# EAGLE design working (EAGLE 6.4)
COMPANY: ADAFRUIT INDUSTRIES; DRAWN: KTOWN; REV: B
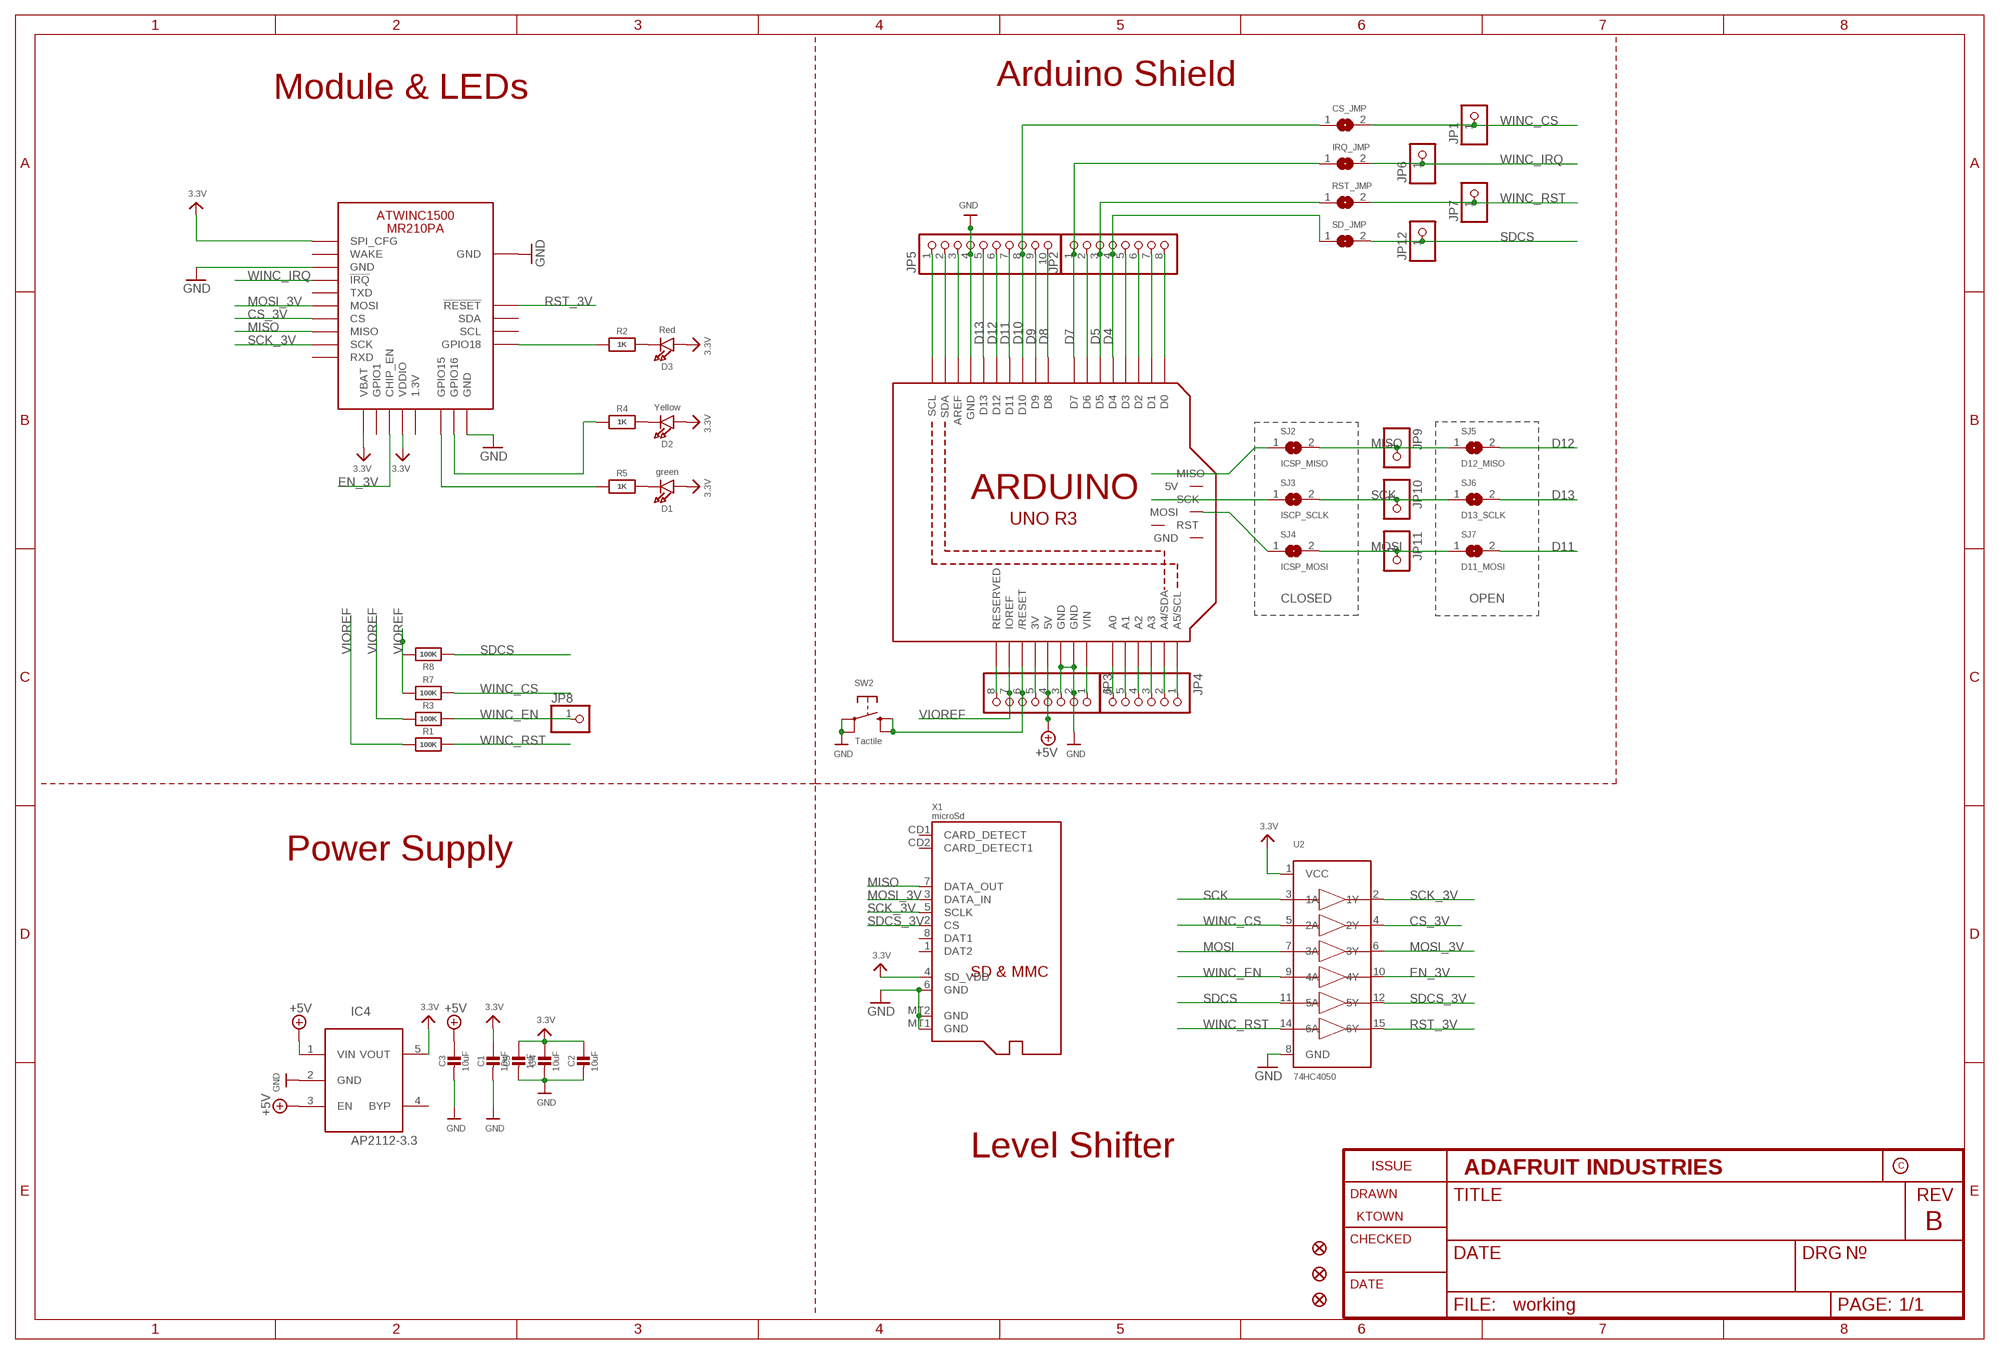
[diagram p0: schematic, sheet 1]

## Parts
C1  10uF  CAP_CERAMIC0805-NOOUTLINE  [0805-NO]
C2  10uF  CAP_CERAMIC0805-NOOUTLINE  [0805-NO]
C3  10uF  CAP_CERAMIC0805-NOOUTLINE  [0805-NO]
C4  10uF  CAP_CERAMIC0805-NOOUTLINE  [0805-NO]
C5  1uF  CAP_CERAMIC0805-NOOUTLINE  [0805-NO]
CS_JMP  SOLDERJUMPERCLOSED  [SOLDERJUMPER_CLOSEDWIRE]
D1  green  LED0805_NOOUTLINE  [CHIPLED_0805_NOOUTLINE]
D2  Yellow  LED0805_NOOUTLINE  [CHIPLED_0805_NOOUTLINE]
D3  Red  LED0805_NOOUTLINE  [CHIPLED_0805_NOOUTLINE]
FID1  FIDUCIAL_1MM  [FIDUCIAL_1MM]
FID2  FIDUCIAL_1MM  [FIDUCIAL_1MM]
FID3  FIDUCIAL_1MM  [FIDUCIAL_1MM]
IC4  AP2112-3.3  LP298XS  [SOT23-5L]
IRQ_JMP  SOLDERJUMPERCLOSED  [SOLDERJUMPER_CLOSEDWIRE]
JP1  HEADER-1X1ROUND  [1X01_ROUND]
JP2  HEADER-1X870MIL  [1X08_ROUND_70]
JP3  HEADER-1X870MIL  [1X08_ROUND_70]
JP4  HEADER-1X670MIL  [1X06_ROUND_70]
JP5  HEADER-1X1070MIL  [1X10_ROUND70]
JP6  HEADER-1X1ROUND  [1X01_ROUND]
JP7  HEADER-1X1ROUND  [1X01_ROUND]
JP8  HEADER-1X1ROUND  [1X01_ROUND]
JP9  HEADER-1X1ROUND  [1X01_ROUND]
JP10  HEADER-1X1ROUND  [1X01_ROUND]
JP11  HEADER-1X1ROUND  [1X01_ROUND]
JP12  HEADER-1X1ROUND  [1X01_ROUND]
M1  ARDUINO_R3_ICSP_NODIM  [ARDUINOR3_ICSP_NODIM]
R1  100K  RESISTOR0805_NOOUTLINE  [0805-NO]
R2  1K  RESISTOR0805_NOOUTLINE  [0805-NO]
R3  100K  RESISTOR0805_NOOUTLINE  [0805-NO]
R4  1K  RESISTOR0805_NOOUTLINE  [0805-NO]
R5  1K  RESISTOR0805_NOOUTLINE  [0805-NO]
R7  100K  RESISTOR0805_NOOUTLINE  [0805-NO]
R8  100K  RESISTOR0805_NOOUTLINE  [0805-NO]
RST_JMP  SOLDERJUMPERCLOSED  [SOLDERJUMPER_CLOSEDWIRE]
SD_JMP  SOLDERJUMPERCLOSED  [SOLDERJUMPER_CLOSEDWIRE]
SJ2  ICSP_MISO  SOLDERJUMPERCLOSED  [SOLDERJUMPER_CLOSEDWIRE]
SJ3  ISCP_SCLK  SOLDERJUMPERCLOSED  [SOLDERJUMPER_CLOSEDWIRE]
SJ4  ICSP_MOSI  SOLDERJUMPERCLOSED  [SOLDERJUMPER_CLOSEDWIRE]
SJ5  D12_MISO  SOLDERJUMPERREFLOW_NOPASTE  [SOLDERJUMPER_REFLOW_NOPASTE]
SJ6  D13_SCLK  SOLDERJUMPERREFLOW_NOPASTE  [SOLDERJUMPER_REFLOW_NOPASTE]
SJ7  D11_MOSI  SOLDERJUMPERREFLOW_NOPASTE  [SOLDERJUMPER_REFLOW_NOPASTE]
SW2  Tactile  SWITCH_TACT_SMT_EVQQ2_SMALL  [EVQ-Q2_SMALLER]
U2  74HC4050  74HC4050D  [SOIC16]
U$1  ATWINC1500_MR210PB  ATWINC1500_MR210PA  [ATWINC1500_MR210PA]
X1  microSd  MICROSD  [MICROSD]

## Nets
3.3V: C1.1 C2.1 C4.1 C5.1 D1.A D2.A D3.A IC4.5(VOUT) U2.1(VCC) U$1.J10(SPI_CFG) U$1.J20(VBAT) U$1.J23(VDDIO) X1.4(SD_VDD)
+3V: JP3.5 M1.3V
+5V: C3.1 IC4.1(VIN) IC4.3(EN) JP3.4 M1.5V
A0: JP4.6 M1.A0
A1: JP4.5 M1.A1
A2: JP4.4 M1.A2
A3: JP4.3 M1.A3
A4: JP4.2 M1.A4(A4/SDA)
A5: JP4.1 M1.A5(A5/SCL)
AREF: JP5.3 M1.AREF
CS_3V: U2.4(2Y) U$1.J16(CS)
D0: JP2.8 M1.D0
D1: JP2.7 M1.D1
D2: JP2.6 M1.D2
D3: JP2.5 M1.D3
D4: JP2.4 M1.D4 SD_JMP.1
D5: JP2.3 M1.D5 RST_JMP.1
D6: JP2.2 M1.D6
D7: IRQ_JMP.1 JP2.1 M1.D7
D8: JP5.10 M1.D8
D9: JP5.9 M1.D9
D10: CS_JMP.1 JP5.8 M1.D10
D11: JP5.7 M1.D11 SJ7.2
D12: JP5.6 M1.D12 SJ5.2
D13: JP5.5 M1.D13 SJ6.2
EN_3V: U2.10(4Y) U$1.J22(CHIP_EN)
GND: C1.2 C2.2 C3.2 C4.2 C5.2 IC4.2(GND) JP3.2 JP3.3 JP5.4 M1.GND M1.GND@1(GND) M1.GND@3(GND) SW2.A'(P1) SW2.A(P) U2.8(GND) U$1.J9(GND) U$1.J12(GND) U$1.J28(GND) U$1.MTGND(GND) X1.6(GND) X1.MT1(GND) X1.MT2(GND)
GPIO15: R5.1 U$1.J26(GPIO15)
GPIO16: R4.1 U$1.J27(GPIO16)
MISO: JP9.1 SJ2.2 SJ5.1 U$1.J17(MISO) X1.7(DATA_OUT)
MISO_ICSP: M1.MISO SJ2.1
MOSI: JP11.1 SJ4.2 SJ7.1 U2.7(3A)
MOSI_3V: U2.6(3Y) U$1.J15(MOSI) X1.3(DATA_IN)
MOSI_ICSP: M1.MOSI SJ4.1
N$1: D3.C R2.2
N$5: D2.C R4.2
N$6: D1.C R5.2
N$8: R2.1 U$1.J1(GPIO18)
NC: JP3.8 M1.RESERVED
RESET: JP3.6 M1.RESET(/RESET) SW2.B'(S1) SW2.B(S)
RST_3V: U2.15(6Y) U$1.J4(!RESET)
SCK: JP10.1 SJ3.2 SJ6.1 U2.3(1A)
SCK_3V: U2.2(1Y) U$1.J18(SCK) X1.5(SCLK)
SCK_ICSP: M1.SCK SJ3.1
SCL: JP5.1 M1.SCL
SDA: JP5.2 M1.SDA
SDCS: JP12.1 R8.1 SD_JMP.2 U2.11(5A)
SDCS_3V: U2.12(5Y) X1.2(CS)
VIN: JP3.1 M1.VIN
VIOREF: JP3.7 M1.IOREF R1.1 R3.1 R7.1 R8.2
WINC_CS: CS_JMP.2 JP1.1 R7.2 U2.5(2A)
WINC_EN: JP8.1 R3.2 U2.9(4A)
WINC_IRQ: IRQ_JMP.2 JP6.1 U$1.J13(!IRQ)
WINC_RST: JP7.1 R1.2 RST_JMP.2 U2.14(6A)
Unconnected: IC4.4(BYP) M1.5V_ICSP(5V) M1.GND@2(GND) M1.RESET_ICSP(RST) U$1.J2(SCL) U$1.J3(SDA) U$1.J11(WAKE) U$1.J14(TXD) U$1.J19(RXD) U$1.J21(GPIO1) U$1.J24(1.3V) X1.1(DAT2) X1.8(DAT1) X1.CD1(CARD_DETECT) X1.CD2(CARD_DETECT1)

## Notes on the sheet
- Arduino Shield
- Module & LEDs
- CLOSED | OPEN
- Power Supply
- Level Shifter

## Library data of the parts
C1-C5 = microbuilder:CAP_CERAMIC: Ceramic Capacitors For new designs, use the packages preceded by an '_' character since they are more reliable: The following footprints should be used on most boards: _0402 - Standard footprint for regular board layouts _0603 - Standard footprint for regular board layouts _0805 - Standard footprint for regular board layouts _1206 - Standard footprint for regular board layouts For extremely tight-pitch boards where space is at a premium, the following 'micro-pitch' footprints can be used (smaller pads, no silkscreen outline, etc.): _0402MP - Micro-pitch footprint for very dense/compact boards _0603MP - Micro-pitch footprint for very dense/compact boards _0805MP - Micro-pitch footprint for very dense/compact boards _1206MP - Micro-pitch footprint for very dense/compact boards
CS_JMP IRQ_JMP RST_JMP SD_JMP SJ2-SJ7 = microbuilder:SOLDERJUMPER: SMD Solder JUMPER Solder the two pads together to create a connection, or remove the solder to break it. REFLOW - Use this footprint for solder paste and reflow ovens. WAVE - Use this footprint for hand-soldering (larger pads). CLOSED - Has a trace between the two pads to ensure it is closed by default. The trace needs to be cut to disable the jumper, and can be closed again by creating a solder bridge between the two pads.
D1-D3 = microbuilder:LED: LED 0603 - 0603 Surface Mount Package 2mA: Green LED - Low Power (3.9mcd, 2ma, 1.7Vf) - Digikey: 475-2709-2-ND Orange LED - Low Power (9.8mcd, 2ma, 1.8Vf) - Digikey: 475-1194-2-ND Red LED - Low Power (5mcd, 2ma, 1.8Vf) - Digikey: 475-1195-2-ND Yellow LED - Low Power (7mcd, 2ma, 1.8Vf) - Digikey: 475-1196-2-ND 5mA: Blue LED - Low Power (17mcd, 5ma, 2.9Vf) - Digikey: LNJ937W8CRACT-ND 0805 - 0805 Surface Mount Package 2mA: Red LED (8.8mcd, 2mA, 1.8Vf, Clear) - Low Power [Digikey: 475-2510-1-ND] Green LED (5mcd, 2mA, 1.8Vf, Clear) - Low Power [Digikey: 475-2730-1-ND] Yellow LED (11.3mcd, 2mA, 1.8Vf, Clear) - Low Power [Digikey: 475-2555-1-ND] 20mA: Red LED (104mcd, 20mA, Diffused) - LS R976 [Digikey: 475-1278-6-ND] Red LED (12mcd, 20mA, 2.0Vf, Clear) - APT2012EC [Digikey: 754-1128-1-ND] Green LED (15mcd, 20mA, 2.2Vf, Clear) - APT2012GC [Digikey: 754-1131-1-ND] Orange LED (160mcd, 20mA, 2.1Vf, Clear) - APT2012SECK [Digikey: 754-1130-1-ND] 1206 - 1206 Surface Mount Package Green LED (26mcd, 20mA, Diffused) - LG N971 [Digikey: 475-1407-6-ND] Red LED (15mcd, 20mA, Diffused) - LH N974 [Digikey: 475-1416-6-ND] Cree - Cree High-Power Surface Mount LEDs XPEBWT-L1-0000-00D50 - White 111lm 350mA 2.9Vf 6200K 110° XTEAWT-00-0000-00000LEE3 - White 114lm 350mA 2.85Vf 5000K 115° Everlight - Everlight 45-21 Series Surface Mount LEDs 45-21/QK2C-B2832AC2CB2/2T - Warm White 2000mcd 20mA 3.25Vf 3050K 120° 45-21/LK2C-B38452C4CB2/2T - Nuetral White 2000mcd 20mA 3.25Vf 4150K 120° 45-21/LK2C-B50634C6CB2/2T - Cold White 2200mcd 20mA 3.25Vf 5650K 120° PLCC2 Reverse Mount LS T77K-J1L2-1-0-2-R18-Z - Red 11.25mcd 2mA 1.8Vf 630nm 120° LO T77K-L1M2-24-Z - Orange 19.6mcd 2mA 1.8Vf 606nm 120° LY T77K-K2M1-26-Z - Yellow 15.7mcd 2mA 1.8Vf 587nm 120°
FID1-FID3 = microbuilder:FIDUCIAL: Fiducial Alignment Points Various fiducial points for machine vision alignment.; BOM: EXCLUDE
IC4 = adafruit:LP298X
JP1 JP6-JP12 = microbuilder:HEADER-1X1: PIN HEADER
JP2 JP3 = microbuilder:HEADER-1X8: PIN HEADER
JP4 = microbuilder:HEADER-1X6: PIN HEADER
JP5 = microbuilder:HEADER-1X10: PIN HEADER
M1 = adafruit:ARDUINO_R3_ICSP
R1-R5 R7 R8 = microbuilder:RESISTOR: Resistors For new designs, use the packages preceded by an '_' character since they are more reliable: The following footprints should be used on most boards: _0402 - Standard footprint for regular board layouts _0603 - Standard footprint for regular board layouts _0805 - Standard footprint for regular board layouts _1206 - Standard footprint for regular board layouts For extremely tight-pitch boards where space is at a premium, the following 'micro-pitch' footprints can be used (smaller pads, no silkscreen outline, etc.): _0402MP - Micro-pitch footprint for very dense/compact boards _0603MP - Micro-pitch footprint for very dense/compact boards _0805MP - Micro-pitch footprint for very dense/compact boards _1206MP - Micro-pitch footprint for very dense/compact boards
SW2 = microbuilder:SWITCH_TACT_SMT: SMT Tact Switches 6x6mm - Digikey: P12940SCT-ND KMR2 (4.6x2.8mm) - Digikey: 401-1426-1-ND EVQ-PQHB55 - Light Touch, 160GF (4.5x4.5mm) - Digikey: P8090SCT-ND KMT0 - KMT021 NGJ LHS (etc.) IP68/Waterproof - Digikey: CKN10289CT-ND
U2 = microbuilder:74HC4050D: 6-channel level shifter 74HC4050D - 2V-6V Supply SOIC16 Digikey: 74HC4050D,653-ND Mouser: 771-74HC4050D-T TSSOP16 Digikey: 296-9215-1-ND Mouser:
U$1 = microbuilder:ATWINC1500_MR210PA: ATWINC1500_MR210PA wifi module
X1 = microbuilder:MICROSD: MicroSD/Transflash Card Holder with SPI pinout 3M: 2908-05WB-MG 4UConnector: 19656 Footprint courtesy: Adafruit Industries

## Board
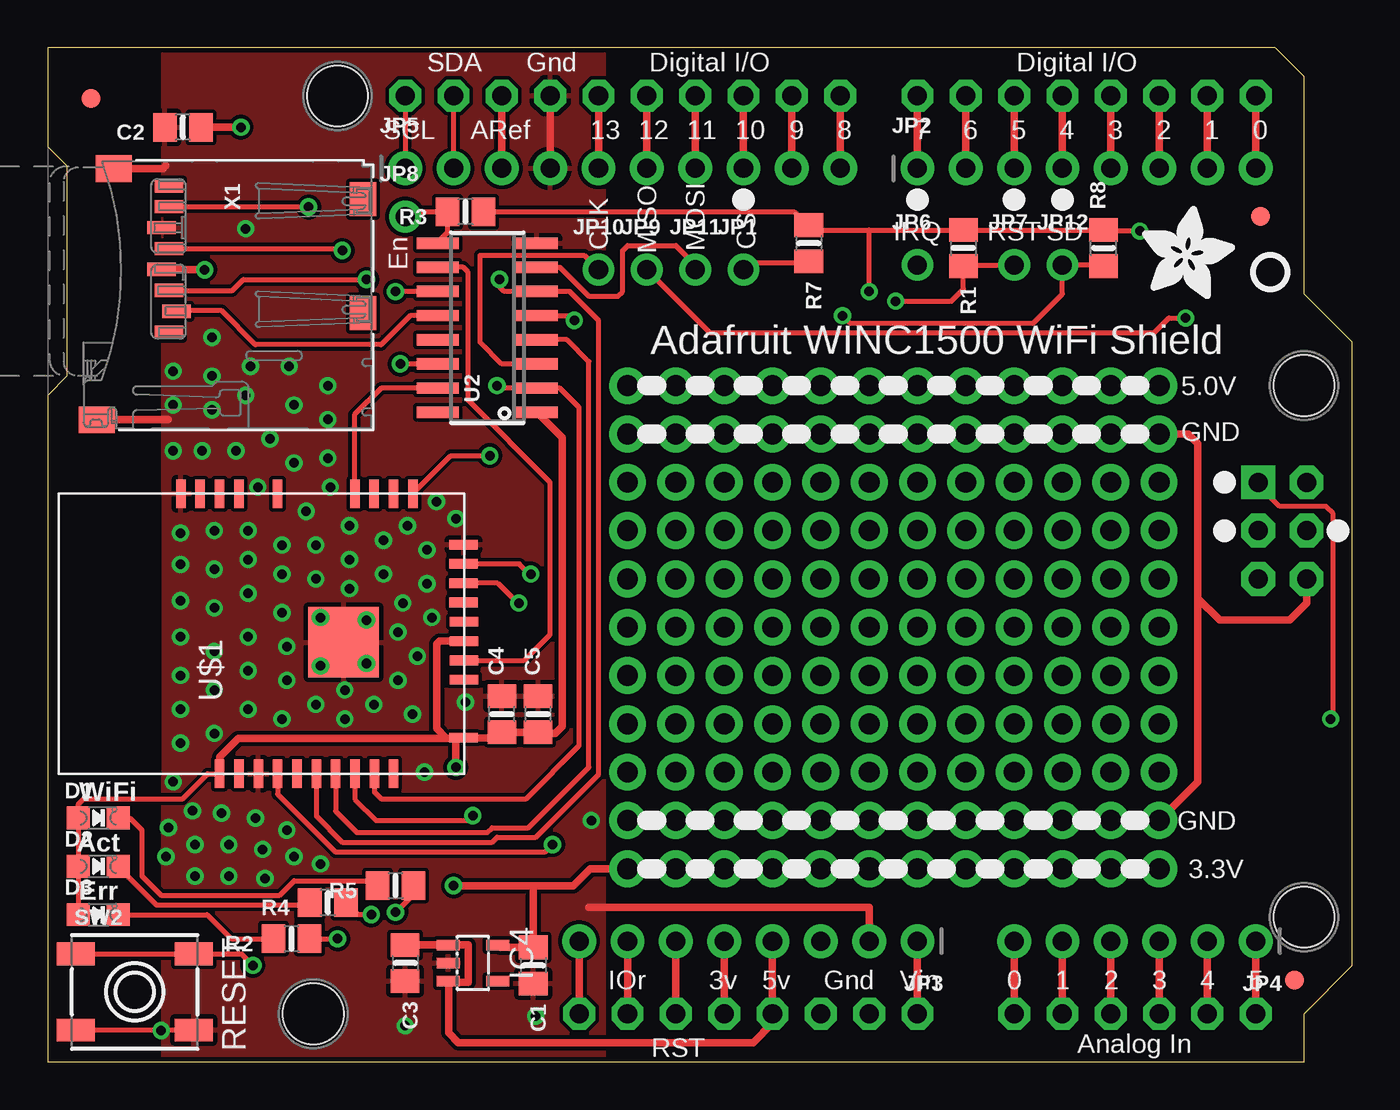
[diagram p1: board, top side]
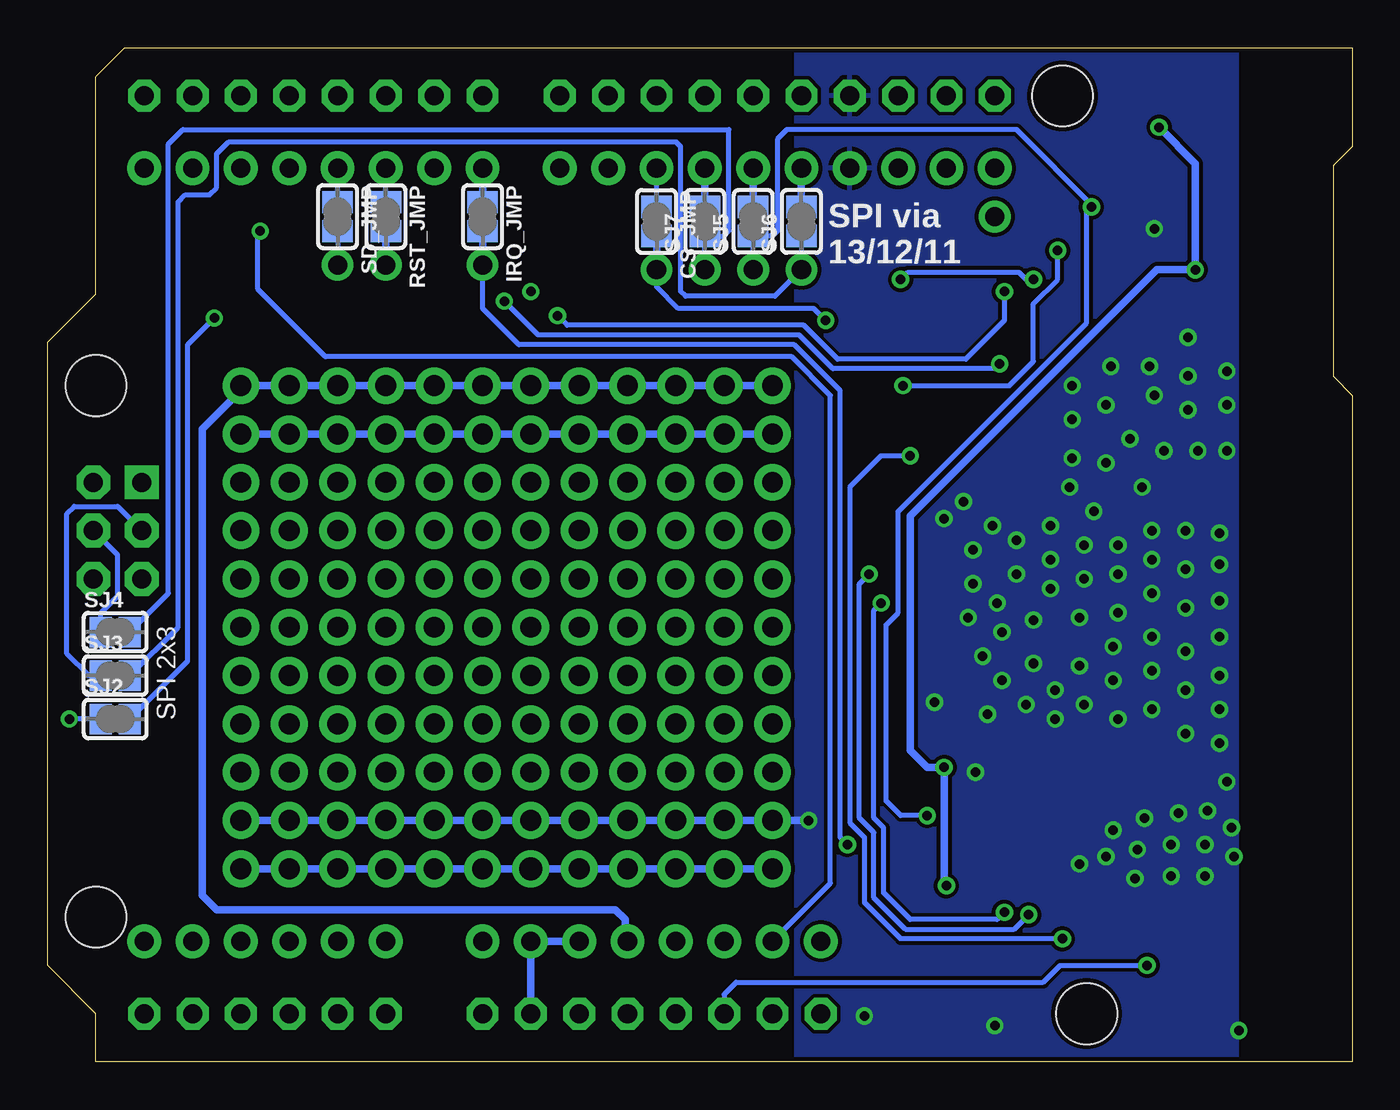
[diagram p2: board, bottom side, seen from below]

Size 68.58 x 53.34 mm. Coordinates in mm from the lower left corner, seen from the top.
Outline: 0,0 66.04,0 66.04,2.54 68.58,5.08 68.58,37.85 66.04,40.39 66.04,51.82 64.52,53.34 0,53.34 0,48.13 1.02,47.12 1.02,36.07 0,35.05 0,0
Copper layers (1*16): Top 0.035mm / dielectric 1.5mm / Bottom 0.035mm
Design rules "adafruit *": minimum track width 8mil, minimum drill 15.5mil, track to track 8mil, track to pad 8mil, pad to pad 8mil, via to via 8mil, smd to smd 8mil, copper to edge 10mil, drill to drill 8mil, minimum pad ring 10mil, minimum via ring 8mil, stop-mask expansion 2mil, vias tented up to drill 20mil, thermal gap 10mil
Holes 3.2 mm at 13.97,2.54 66.04,35.56 66.04,7.62 15.24,50.8

### Footprints (pad centres in the part's own frame; a part is rotated, then mirrored left to right if it is on the bottom)
0805-NO = smd 1.24 x 1.5: 1 -0.95,0; 2 0.95,0
SOLDERJUMPER_CLOSEDWIRE = smd 1.168 x 1.6: 1 -0.762,0; 2 0.762,0 | smd 0.635 x 0.203: WIRE 0,0
CHIPLED_0805_NOOUTLINE = smd 1.2 x 1.2: A 0,-1.05; C 0,1.05
FIDUCIAL_1MM = smd 1 x 1: 1 0,0
SOT23-5L = smd 0.55 x 1.2: 1 -0.95,-1.3; 2 0,-1.3; 3 0.95,-1.3; 4 0.95,1.3; 5 -0.95,1.3
1X01_ROUND = drill 1 pad 1.676: 1 0,0
1X08_ROUND_70 = drill 1 pad 1.778: 1 -8.89,0; 2 -6.35,0; 3 -3.81,0; 4 -1.27,0; 5 1.27,0; 6 3.81,0; 7 6.35,0; 8 8.89,0
1X06_ROUND_70 = drill 1 pad 1.778: 1 -6.35,0; 2 -3.81,0; 3 -1.27,0; 4 1.27,0; 5 3.81,0; 6 6.35,0
1X10_ROUND70 = drill 1 pad 1.778: 1 -11.43,0; 2 -8.89,0; 3 -6.35,0; 4 -3.81,0; 5 -1.27,0; 6 1.27,0; 7 3.81,0; 8 6.35,0; 9 8.89,0; 10 11.43,0
ARDUINOR3_ICSP_NODIM = drill 1 pad 1.676 octagon: 3V 35.56,2.54; 5V 38.1,2.54; A0 50.8,2.54; A1 53.34,2.54; A2 55.88,2.54; A3 58.42,2.54; A4 60.96,2.54; A5 63.5,2.54; AREF 23.876,50.8; D0 63.5,50.8; D1 60.96,50.8; D2 58.42,50.8; D3 55.88,50.8; D4 53.34,50.8; D5 50.8,50.8; D6 48.26,50.8; D7 45.72,50.8; D8 41.656,50.8; D9 39.116,50.8; D10 36.576,50.8; D11 34.036,50.8; D12 31.496,50.8; D13 28.956,50.8; GND 26.416,50.8; GND@1 43.18,2.54; GND@2 40.64,2.54; IOREF 30.48,2.54; RESERVED 27.94,2.54; RESET 33.02,2.54; SCL 18.796,50.8; SDA 21.336,50.8; VIN 45.72,2.54 | drill 1 pad 1.778 octagon: 5V_ICSP 66.167,30.48; GND@3 66.167,25.4; MOSI 66.167,27.94; RESET_ICSP 63.627,25.4; SCK 63.627,27.94 | drill 1 pad 1.778 square: MISO 63.627,30.48
SOLDERJUMPER_REFLOW_NOPASTE = smd 1.168 x 1.6: 1 -0.762,0; 2 0.762,0
EVQ-Q2_SMALLER = smd 2 x 1.2: A -3.1,-2; A' 3.1,-2; B -3.1,2; B' 3.1,2
SOIC16 = smd 0.6 x 2.2: 1 -4.445,-2.6; 2 -3.175,-2.6; 3 -1.905,-2.6; 4 -0.635,-2.6; 5 0.635,-2.6; 6 1.905,-2.6; 7 3.175,-2.6; 8 4.445,-2.6; 9 4.445,2.6; 10 3.175,2.6; 11 1.905,2.6; 12 0.635,2.6; 13 -0.635,2.6; 14 -1.905,2.6; 15 -3.175,2.6; 16 -4.445,2.6
ATWINC1500_MR210PA = smd 1.5 x 0.5: J1 7.146,-4.973; J2 7.146,-3.957; J3 7.146,-2.941; J4 7.146,-1.925; J5 7.146,2.139; J6 7.146,4.171; J7 7.146,5.187; J8 7.146,6.203; J9 7.146,7.219; J10 -7.584,5.181; J11 -7.584,4.165; J12 -7.584,3.149; J13 -7.584,2.133; J14 -7.584,1.117; J15 -7.584,0.101; J16 -7.584,-0.915; J17 -7.584,-1.931; J18 -7.584,-2.947; J19 -7.584,-3.963 | smd 0.5 x 1.5: J20 -5.684,-7.643; J21 -2.636,-7.663; J22 -1.62,-7.663; J23 -0.604,-7.663; J24 0.412,-7.663; J25 1.428,-7.643; J26 2.444,-7.643; J27 3.46,-7.643; J28 4.476,-7.643 | smd 3.7 x 3.7: MTGND -0.666,-1.331
MICROSD = smd 0.7 x 1.5: 1 9,-10.64; 2 7.9,-10.24; 3 6.8,-10.64; 4 5.7,-11.04; 5 4.6,-10.64; 6 3.5,-11.04; 7 2.4,-10.64; 8 1.3,-10.64 | smd 1.8 x 1.4: CD1 2,-0.44; CD2 8,-0.44 | smd 1.4 x 1.9: MT1 0.4,-13.54; MT2 13.6,-14.44

### Placement (x,y rotation side)
C1  25.53,5.08 270 top
C2  7.11,49.15 180 top
C3  18.8,5.21 270 top
C4  23.88,18.29 90 top
C5  25.78,18.29 90 top
CS_JMP  36.58,44.2 270 bottom
D1  2.67,12.83 270 top
D2  2.67,10.29 270 top
D3  2.67,7.75 270 top
FID1  63.75,44.45 0 top
FID2  65.53,4.32 0 top
FID3  2.29,50.67 0 top
IC4  22.35,5.21 270 top
IRQ_JMP  45.72,44.45 270 bottom
JP1  36.58,41.66 0 top
JP2  54.61,46.99 0 top
JP3  36.83,6.35 180 top
JP4  57.15,6.35 180 top
JP5  30.23,46.99 0 top
JP6  45.72,41.91 0 top
JP7  50.8,41.91 0 top
JP8  18.8,44.45 0 top
JP9  31.5,41.66 0 top
JP10  28.96,41.66 0 top
JP11  34.04,41.66 0 top
JP12  53.34,41.91 0 top
M1  0,0 0 top
R1  48.13,42.8 270 top
R2  12.83,6.48 180 top
R3  21.97,44.7 180 top
R4  14.73,8.38 180 top
R5  18.29,9.27 180 top
R7  40.01,43.05 270 top
R8  55.5,42.8 90 top
RST_JMP  50.8,44.45 270 bottom
SD_JMP  53.34,44.45 270 bottom
SJ2  65.02,18.03 0 bottom
SJ3  65.02,20.32 0 bottom
SJ4  65.02,22.61 0 bottom
SJ5  31.5,44.2 90 bottom
SJ6  28.96,44.2 90 bottom
SJ7  34.04,44.2 90 bottom
SW2  4.57,3.68 0 top
U2  23.11,38.61 90 top
U$1  14.22,22.73 90 top
U$9  [ADAFRUIT_5MM]  57.53,40.13 0 top
U$21  [PCBFEAT-REV-040]  64.26,41.53 0 top
X1  17.02,47.37 270 top

### Tracks (layer width: path | path; a pad name or v marks a point on that pad's centre or on a via)
3.3V  (via drill 0.5, 1.1 pad 1.93, 1.2 pad 1.93)
  Top 0.254: 9.14,15.05 U$1.J10 8.42,15.15 7.11,13.84 1.91,13.84 1.62,13.55 D1.A D2.A D3.A
  Top 0.406: X1.4 8.24,41.67 v8.26,41.66 | v10.16,49.15 C2.1 | IC4.5 23.78,6.03 C1.1 25.53,9.27 | U$1.J23 20.61,22.13 20.45,21.97 20.45,17.53 20.95,17.02 | 20.95,17.02 21.45,17.02 | U$1.J10 9.04,16.03 10.03,17.02 20.95,17.02 | U2.1 27.05,32.83 27.05,17.65 26.67,17.27 25.85,17.27 C5.1 C4.1 23.59,17.05 U$1.J20 21.45,17.05 21.45,17.02 | 25.53,9.27 27.63,9.27 28.52,10.16 v30.48,10.16 | 25.53,9.27 v21.34,9.27 | 21.45,17.02 v21.45,15.49 v21.46,15.49
  Bottom 0.406: v58.42,10.16 v55.88,10.16 v53.34,10.16 v50.8,10.16 v48.26,10.16 v45.72,10.16 v43.18,10.16 v40.64,10.16 v38.1,10.16 v35.56,10.16 v33.02,10.16 v30.48,10.16 | v10.16,49.15 8.26,47.24 v8.26,41.66 10.29,41.66 23.24,28.7 23.24,16.38 22.35,15.49 v21.46,15.49 21.46,9.4 v21.34,9.27
+3V
  Top 0.406: M1.3V JP3.5
+5V  (via drill 1.1 pad 1.93)
  Top 0.406: JP3.4 M1.5V 38.1,2.03 37.08,1.02 21.59,1.02 21.08,1.52 21.08,4.26 IC4.3 21.05,4.19 22.1,4.19 22.1,6.16 IC4.1 C3.1
  Bottom 0.406: v58.42,35.56 58.17,35.56 | 58.17,35.56 v55.88,35.56 v53.34,35.56 v50.8,35.56 v48.26,35.56 v45.72,35.56 v43.18,35.56 v40.64,35.56 v38.1,35.56 v35.56,35.56 v33.02,35.56 v30.48,35.56 | 58.17,35.56 60.45,33.27 60.45,8.76 59.69,8 38.73,8 38.23,7.49 38.23,6.48 JP3.4
A0
  Top 0.406: JP4.6 M1.A0
A1
  Top 0.406: JP4.5 M1.A1
A2
  Top 0.406: JP4.4 M1.A2
A3
  Top 0.406: JP4.3 M1.A3
A4
  Top 0.406: JP4.2 M1.A4
A5
  Top 0.406: M1.A5 JP4.1
AREF
  Top 0.406: JP5.3 M1.AREF
CS_3V
  Top 0.254: U$1.J16 15.14,13.18 16.26,12.06 23.11,12.06 23.37,12.32 25.27,12.32 28.45,15.49 28.45,36.83 27.3,37.97 U2.4
D0
  Top 0.406: M1.D0 JP2.8
D1
  Top 0.406: M1.D1 JP2.7
D2
  Top 0.406: M1.D2 JP2.6
D3
  Top 0.406: M1.D3 JP2.5
D4
  Top 0.406: M1.D4 JP2.4
  Bottom 0.254: SD_JMP.1 JP2.4
D5
  Top 0.406: M1.D5 JP2.3
  Bottom 0.254: RST_JMP.1 JP2.3
D6
  Top 0.406: M1.D6 JP2.2
D7
  Top 0.406: M1.D7 JP2.1
  Bottom 0.406: JP2.1 IRQ_JMP.1
D8
  Top 0.406: M1.D8 JP5.10
D9
  Top 0.406: M1.D9 JP5.9
D10
  Top 0.406: M1.D10 JP5.8
  Bottom 0.254: CS_JMP.1 JP5.8
D11
  Top 0.406: M1.D11 JP5.7
  Bottom 0.406: JP5.7 SJ7.2
D12
  Top 0.406: M1.D12 JP5.6
  Bottom 0.406: JP5.6 SJ5.2
D13
  Top 0.406: M1.D13 JP5.5
  Bottom 0.406: JP5.5 SJ6.2
EN_3V
  Top 0.254: U$1.J22 25.05,21.11 26.42,22.48 26.42,30.48 22.1,34.8 22.1,41.53 21.84,41.78 U2.10
GND  (via drill 0.5, 1.1 pad 1.93)
  Top 0.254: SW2.A SW2.A'
  Top 0.406: M1.GND JP5.4 | v58.42,33.02 59.94,33.02 60.45,32.51 60.45,24.38 | 60.45,24.38 61.59,23.24 65.28,23.24 66.17,24.13 M1.GND@3 | v58.42,12.7 60.45,14.73 60.45,24.38 | JP3.2 43.18,8.13 28.45,8.13 | X1.MT1 6.08,46.97 6.22,47.12 | X1.MT2 6.34,33.77 6.35,33.78
  Bottom 0.406: v58.42,12.7 v55.88,12.7 v53.34,12.7 v50.8,12.7 v48.26,12.7 v45.72,12.7 v43.18,12.7 v40.64,12.7 v38.1,12.7 v35.56,12.7 v33.02,12.7 v30.48,12.7 28.7,12.7 | v58.42,33.02 v55.88,33.02 v53.34,33.02 v50.8,33.02 v48.26,33.02 v45.72,33.02 v43.18,33.02 v40.64,33.02 v38.1,33.02 v35.56,33.02 v33.02,33.02 v30.48,33.02 | JP3.3 JP3.2 M1.GND@1
  other vias: 28.57,12.7 10.41,43.81 6.6,32.13 14.35,23.37 16.76,23.24 16.76,20.95 14.35,20.83 21.46,28.57 21.97,18.92 19.81,15.24 5.97,1.65 18.8,1.91 25.65,2.41 9.14,13.08 12.57,12.19 6.99,27.81 6.99,26.16 6.99,24.26 6.99,22.35 6.99,20.32 6.99,18.54 6.99,16.76 6.6,14.73 8.76,17.27 8.76,19.56 8.76,21.59 8.76,23.88 8.76,25.91 8.76,27.94 10.54,27.94 10.54,26.42 10.54,24.64 10.54,22.35 10.54,20.57 10.54,18.54 12.32,18.03 12.57,20.07 12.57,21.84 12.32,23.62 12.32,25.65 12.32,27.18 13.59,28.96 11.05,30.23 14.1,27.18 14.1,25.4 15.88,24.89 15.88,26.42 15.88,28.19 14.86,30.23 12.95,31.5 17.65,25.65 17.65,27.43 18.92,28.19 20.45,29.46 19.94,26.92 19.94,25.15 18.67,24.13 20.19,23.37 18.41,22.61 19.43,21.34 18.41,20.07 19.18,18.29 17.14,18.8 15.62,18.03 15.62,19.56 14.1,18.8 8.13,32.13 9.91,32.13 11.68,32.77 14.73,31.75 14.73,33.78 12.95,34.54 10.41,35.05 8.64,34.29 6.6,34.54 6.6,36.32 8.64,36.07 8.64,38.1 10.67,36.58 12.7,36.58 14.73,35.56 10.92,12.83 7.62,13.21 6.35,12.32 6.22,10.79 7.75,9.78 7.75,11.43 9.53,11.43 9.53,9.78 11.3,11.18 11.43,9.65 12.95,10.79 14.35,10.41
  pour Top: 29.21,53.34 29.21,0 6.1,0 6.1,53.34
  pour Bottom: 6.1,53.34 6.1,0 29.21,0 29.21,53.34
GPIO15  (via drill 0.5)
  Top 0.254: U$1.J26 23.65,25.18 24.7,24.13 v24.77,24.13 | R5.1 19.24,8.82 v18.29,7.87
  Bottom 0.254: v18.29,7.87 18.67,7.49 23.24,7.49 24.64,8.89 24.64,12.32 25.15,12.83 25.15,23.75 v24.77,24.13
GPIO16  (via drill 0.5)
  Top 0.254: U$1.J27 24.8,26.19 25.34,25.65 v25.4,25.65 | v17.02,7.75 16.32,7.75 R4.1
  Bottom 0.254: v17.02,7.75 17.78,6.99 23.5,6.99 25.15,8.64 25.15,12.06 25.91,12.83 25.91,25.15 v25.4,25.65
MISO  (via drill 0.5)
  Top 0.254: U$1.J17 16.16,13.82 17.27,12.7 22.1,12.7 v22.35,12.95 | JP9.1 34.8,38.35 58.17,38.35 58.93,39.12 v59.82,39.12 | X1.7 v13.72,44.97 v13.72,44.96
  Bottom 0.254: SJ2.2 61.21,21.08 61.21,37.72 v59.82,39.12 | JP9.1 SJ5.1 30.48,43.43 30.23,43.69 30.23,48.51 29.72,49.02 17.65,49.02 13.59,44.96 v13.72,44.96 | v22.35,12.95 23.75,12.95 24.51,13.72 24.51,22.99 23.88,23.62 23.88,28.96 13.97,38.86 13.97,44.7 v13.72,44.96 | 13.84,44.96 v13.72,44.96
MISO_ICSP  (via drill 0.5)
  Top 0.254: v67.44,18.03 67.56,18.16 67.56,28.83 67.18,29.21 64.77,29.21 63.63,30.35 M1.MISO
  Bottom 0.254: SJ2.1 v67.44,18.03
MOSI
  Top 0.254: U2.7 26.92,41.78 28.45,40.26 29.97,40.26 30.23,40.51 30.23,42.67 30.48,42.93 33.02,42.93 34.04,41.91 JP11.1
  Bottom 0.254: SJ4.2 62.23,24.64 62.23,48.26 61.47,49.02 32.77,49.02 32.77,43.69 33.02,43.43 SJ7.1 JP11.1
MOSI_3V  (via drill 0.5)
  Top 0.254: U$1.J15 14.12,12.93 15.49,11.56 23.37,11.56 23.62,11.81 25.65,11.81 28.96,15.11 28.96,38.99 27.43,40.51 U2.6 24,40.51 23.75,40.77 v23.75,41.15 | X1.3 9.71,40.57 10.29,41.15 v16.76,41.15
  Bottom 0.254: v23.75,41.15 23.37,41.53 17.53,41.53 17.14,41.15 v16.76,41.15
MOSI_ICSP
  Bottom 0.254: SJ4.1 65.79,23.62 64.9,24.51 64.9,26.67 M1.MOSI
N$1
  Top 0.254: D3.C 8.38,7.75 9.65,6.48 R2.2
N$2  (via drill 1.1 pad 1.93)
  other vias: 58.42,27.94
N$3  (via drill 1.1 pad 1.93)
  other vias: 58.42,25.4
N$4  (via drill 1.1 pad 1.93)
  other vias: 58.42,22.86
N$5
  Top 0.254: D2.C 3.72,10.25 5.71,8.26 13.65,8.26 R4.2
N$6
  Top 0.254: D1.C 4.32,12.83 4.95,12.19 4.95,9.78 5.97,8.76 12.19,8.76 12.95,9.53 17.08,9.53 R5.2
N$7  (via drill 1.1 pad 1.93)
  other vias: 58.42,20.32
N$8  (via drill 0.5)
  Top 0.254: R2.1 v15.24,6.48 | U$1.J1 21.2,31.88 v23.24,31.88
  Bottom 0.254: v23.24,31.88 24.77,31.88 26.42,30.23 26.42,12.57 25.65,11.81 25.65,8.38 23.75,6.48 v15.24,6.48
N$9  (via drill 1.1 pad 1.93)
  other vias: 58.42,17.78
N$10  (via drill 1.1 pad 1.93)
  other vias: 43.18,27.94
N$12  (via drill 1.1 pad 1.93)
  other vias: 45.72,27.94
N$13  (via drill 1.1 pad 1.93)
  other vias: 48.26,27.94
N$18  (via drill 1.1 pad 1.93)
  other vias: 33.02,25.4
N$19  (via drill 1.1 pad 1.93)
  other vias: 50.8,27.94
N$20  (via drill 1.1 pad 1.93)
  other vias: 53.34,27.94
N$21  (via drill 1.1 pad 1.93)
  other vias: 43.18,25.4
N$22  (via drill 1.1 pad 1.93)
  other vias: 45.72,25.4
N$23  (via drill 1.1 pad 1.93)
  other vias: 48.26,25.4
N$24  (via drill 1.1 pad 1.93)
  other vias: 58.42,30.48
N$25  (via drill 1.1 pad 1.93)
  other vias: 55.88,30.48
N$26  (via drill 1.1 pad 1.93)
  other vias: 50.8,25.4
N$27  (via drill 1.1 pad 1.93)
  other vias: 50.8,30.48
N$28  (via drill 1.1 pad 1.93)
  other vias: 48.26,30.48
N$29  (via drill 1.1 pad 1.93)
  other vias: 45.72,30.48
N$30  (via drill 1.1 pad 1.93)
  other vias: 43.18,30.48
N$31  (via drill 1.1 pad 1.93)
  other vias: 33.02,27.94
N$32  (via drill 1.1 pad 1.93)
  other vias: 30.48,27.94
N$33  (via drill 1.1 pad 1.93)
  other vias: 30.48,30.48
N$35  (via drill 1.1 pad 1.93)
  other vias: 33.02,30.48
N$36  (via drill 1.1 pad 1.93)
  other vias: 55.88,27.94
N$37  (via drill 1.1 pad 1.93)
  other vias: 53.34,25.4
N$38  (via drill 1.1 pad 1.93)
  other vias: 30.48,25.4
N$39  (via drill 1.1 pad 1.93)
  other vias: 30.48,22.86
N$40  (via drill 1.1 pad 1.93)
  other vias: 30.48,20.32
N$41  (via drill 1.1 pad 1.93)
  other vias: 30.48,17.78
N$42  (via drill 1.1 pad 1.93)
  other vias: 30.48,15.24
N$50  (via drill 1.1 pad 1.93)
  other vias: 55.88,25.4
N$51  (via drill 1.1 pad 1.93)
  other vias: 48.26,22.86
N$53  (via drill 1.1 pad 1.93)
  other vias: 45.72,22.86
N$54  (via drill 1.1 pad 1.93)
  other vias: 43.18,20.32
N$55  (via drill 1.1 pad 1.93)
  other vias: 45.72,20.32
N$56  (via drill 1.1 pad 1.93)
  other vias: 55.88,22.86
N$57  (via drill 1.1 pad 1.93)
  other vias: 53.34,22.86
N$58  (via drill 1.1 pad 1.93)
  other vias: 50.8,22.86
N$83  (via drill 1.1 pad 1.93)
  other vias: 48.26,20.32
N$84  (via drill 1.1 pad 1.93)
  other vias: 50.8,20.32
N$85  (via drill 1.1 pad 1.93)
  other vias: 53.34,20.32
N$86  (via drill 1.1 pad 1.93)
  other vias: 55.88,20.32
N$87  (via drill 1.1 pad 1.93)
  other vias: 43.18,17.78
N$88  (via drill 1.1 pad 1.93)
  other vias: 45.72,17.78
N$101  (via drill 1.1 pad 1.93)
  other vias: 48.26,17.78
N$102  (via drill 1.1 pad 1.93)
  other vias: 50.8,17.78
N$103  (via drill 1.1 pad 1.93)
  other vias: 53.34,17.78
N$104  (via drill 1.1 pad 1.93)
  other vias: 55.88,17.78
N$105  (via drill 1.1 pad 1.93)
  other vias: 55.88,15.24
N$106  (via drill 1.1 pad 1.93)
  other vias: 53.34,15.24
N$107  (via drill 1.1 pad 1.93)
  other vias: 50.8,15.24
N$108  (via drill 1.1 pad 1.93)
  other vias: 48.26,15.24
N$109  (via drill 1.1 pad 1.93)
  other vias: 45.72,15.24
N$110  (via drill 1.1 pad 1.93)
  other vias: 43.18,15.24
N$111  (via drill 1.1 pad 1.93)
  other vias: 43.18,22.86
N$112  (via drill 1.1 pad 1.93)
  other vias: 58.42,15.24
N$118  (via drill 1.1 pad 1.93)
  other vias: 40.64,30.48
N$119  (via drill 1.1 pad 1.93)
  other vias: 40.64,27.94
N$130  (via drill 1.1 pad 1.93)
  other vias: 53.34,30.48
N$131  (via drill 1.1 pad 1.93)
  other vias: 40.64,22.86
N$142  (via drill 1.1 pad 1.93)
  other vias: 40.64,20.32
N$143  (via drill 1.1 pad 1.93)
  other vias: 40.64,17.78
N$164  (via drill 1.1 pad 1.93)
  other vias: 40.64,15.24
N$165  (via drill 1.1 pad 1.93)
  other vias: 40.64,25.4
N$172  (via drill 1.1 pad 1.93)
  other vias: 38.1,30.48
N$173  (via drill 1.1 pad 1.93)
  other vias: 38.1,27.94
N$174  (via drill 1.1 pad 1.93)
  other vias: 38.1,25.4
N$175  (via drill 1.1 pad 1.93)
  other vias: 38.1,22.86
N$185  (via drill 1.1 pad 1.93)
  other vias: 38.1,20.32
N$186  (via drill 1.1 pad 1.93)
  other vias: 38.1,17.78
N$187  (via drill 1.1 pad 1.93)
  other vias: 38.1,15.24
N$188  (via drill 1.1 pad 1.93)
  other vias: 35.56,15.24
N$189  (via drill 1.1 pad 1.93)
  other vias: 35.56,17.78
N$190  (via drill 1.1 pad 1.93)
  other vias: 35.56,20.32
N$191  (via drill 1.1 pad 1.93)
  other vias: 35.56,22.86
N$192  (via drill 1.1 pad 1.93)
  other vias: 33.02,22.86
N$193  (via drill 1.1 pad 1.93)
  other vias: 33.02,20.32
N$194  (via drill 1.1 pad 1.93)
  other vias: 33.02,17.78
N$195  (via drill 1.1 pad 1.93)
  other vias: 33.02,15.24
N$196  (via drill 1.1 pad 1.93)
  other vias: 35.56,25.4
N$197  (via drill 1.1 pad 1.93)
  other vias: 35.56,30.48
N$198  (via drill 1.1 pad 1.93)
  other vias: 35.56,27.94
NC
  Top 0.406: JP3.8 M1.RESERVED
RESET  (via drill 0.5)
  Top 0.254: SW2.B SW2.B' 10.19,5.68 v10.79,5.08
  Top 0.406: M1.RESET JP3.6
  Bottom 0.254: M1.RESET 33.02,3.56 32.38,4.19 16.26,4.19 15.37,5.08 v10.79,5.08
RST_3V
  Top 0.254: U2.15 17.53,35.43 16.13,34.04 16.13,29.9 U$1.J4
SCK
  Top 0.254: U2.3 23.88,36.7 22.73,37.85 22.73,42.42 28.19,42.42 JP10.1
  Bottom 0.254: SJ3.2 61.72,22.86 61.72,45.21 61.34,45.59 60.07,45.59 59.69,45.97 59.69,47.75 59.05,48.39 35.56,48.39 35.31,48.13 35.31,40.51 35.05,40.26 30.35,40.26 JP10.1 | SJ6.1 JP10.1 | 28.96,41.53 JP10.1
SCK_3V  (via drill 0.5)
  Top 0.254: U$1.J18 17.17,14.2 17.53,13.84 25.15,13.84 27.94,16.64 27.94,34.42 26.92,35.43 U2.2 23.75,35.43 v23.62,35.56 | X1.5 15.39,42.77 v15.49,42.67
  Bottom 0.254: v23.62,35.56 18.03,35.56 16.76,36.83 16.76,39.88 15.49,41.15 v15.49,42.67
SCK_ICSP
  Bottom 0.254: SJ3.1 66.42,20.32 67.56,21.46 67.56,28.83 67.18,29.21 64.9,29.21 M1.SCK
SCL
  Top 0.254: M1.SCL JP5.1
SDA
  Top 0.254: JP5.2 M1.SDA
SDCS  (via drill 0.5)
  Top 0.254: U2.11 v18.29,40.51 | v41.78,39.24 42.16,38.86 51.82,38.86 53.34,40.39 JP12.1 55.5,41.91 R8.1
  Top 0.406: 55.5,41.91 55.44,41.91
  Bottom 0.254: SD_JMP.2 JP12.1 | v18.29,40.51 18.29,38.99 20.32,36.96 27.05,36.96 28.83,38.73 41.27,38.73 v41.78,39.24
SDCS_3V
  Top 0.254: U2.12 19.05,39.24 17.53,37.72 10.92,37.72 9.14,39.5 6.8,39.5 X1.2
VIN
  Top 0.406: JP3.1 M1.VIN
VIOREF  (via drill 0.5)
  Top 0.254: 43.18,43.75 R1.1 R8.2 55.56,43.69 v57.4,43.69 | v43.18,40.51 43.18,43.75 | 43.18,43.75 40.26,43.75 R7.1 39.94,44 39.24,44.7 R3.1
  Top 0.406: JP3.7 M1.IOREF
  Bottom 0.254: 30.48,5.84 JP3.7 27.43,9.4 27.43,35.05 29.46,37.08 53.98,37.08 57.53,40.64 57.53,43.56 v57.4,43.69 | 43.18,40.26 v43.18,40.51
WINC_CS  (via drill 0.5)
  Top 0.254: JP1.1 36.96,42.04 39.94,42.04 R7.2 | U2.5 27.43,39.24 v27.69,38.99
  Bottom 0.254: 36.45,41.53 JP1.1 36.58,40.77 35.43,39.62 28.32,39.62 v27.69,38.99
  Bottom 0.406: CS_JMP.2 JP1.1
WINC_EN
  Top 0.254: U2.9 20.45,43.05 21.02,43.63 R3.2 19.05,44.7 JP8.1
WINC_IRQ  (via drill 0.5)
  Top 0.254: U$1.J13 12.09,14.07 15.11,11.05 26.16,11.05 v26.54,11.43
  Bottom 0.254: 45.59,42.04 JP6.1 45.72,39.62 43.81,37.72 29.34,37.72 26.92,35.31 26.92,11.81 v26.54,11.43
  Bottom 0.406: IRQ_JMP.2 JP6.1
WINC_RST  (via drill 0.5)
  Top 0.254: JP7.1 48.19,41.91 R1.2 48.13,40.64 47.5,40.01 v44.58,40.01 | U2.14 v18.54,36.7
  Bottom 0.254: v18.54,36.7 18.8,36.45 27.3,36.45 29.08,38.23 42.8,38.23 v44.58,40.01
  Bottom 0.406: RST_JMP.2 JP7.1

### Text on the board
tPlace: CLK | MISO | MOSI | CS | IRQ | RST | SD | En | Adafruit WINC1500 WiFi Shield | 5.0V | GND | WiFi | GND | Act | 3.3V | Err | RESET
bPlace: SPI via / 13/12/11 | SPI 2x3